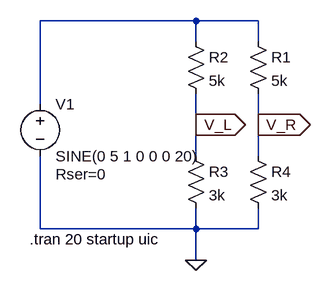
[diagram p0: schematic Wheatstone Bridge.asc]
Wheatstone Bridge.asc, the LTspice schematic file:
Version 4.1
SHEET 1 880 680
WIRE 272 -16 32 -16
WIRE 368 -16 272 -16
WIRE 272 16 272 -16
WIRE 368 16 368 -16
WIRE 32 112 32 -16
WIRE 272 144 272 96
WIRE 368 144 368 96
WIRE 272 192 272 144
WIRE 368 192 368 144
WIRE 32 304 32 192
WIRE 272 304 272 272
WIRE 272 304 32 304
WIRE 368 304 368 272
WIRE 368 304 272 304
WIRE 272 352 272 304
FLAG 272 144 V_L
IOPIN 272 144 Out
FLAG 368 144 V_R
IOPIN 368 144 Out
FLAG 272 352 0
SYMBOL voltage 32 96 R0
WINDOW 123 0 0 Left 0
WINDOW 39 24 124 Left 2
SYMATTR InstName V1
SYMATTR Value SINE(0 5 1 0 0 0 20)
SYMATTR SpiceLine Rser=0
SYMBOL res 352 0 R0
SYMATTR InstName R1
SYMATTR Value 5k
SYMBOL res 256 0 R0
SYMATTR InstName R2
SYMATTR Value 5k
SYMBOL res 256 176 R0
SYMATTR InstName R3
SYMATTR Value 3k
SYMBOL res 352 176 R0
SYMATTR InstName R4
SYMATTR Value 3k
TEXT 16 320 Left 2 !.tran 20 startup uic

The netlist it stands for:
* Wheatstone Bridge.asc
V1 N001 0 SINE(0 5 1 0 0 0 20) Rser=0
R1 N001 V_R 5k
R2 N001 V_L 5k
R3 V_L 0 3k
R4 V_R 0 3k
.tran 20 startup uic
.backanno
.end